# Altium schematic sheet magic_baton_top.SchDoc: Magic Baton: Top Sheet
size Letter; Organization: UBC ECE Capstone 2020S; Address1: Team 8; Address3: Magic Baton; Revision: A
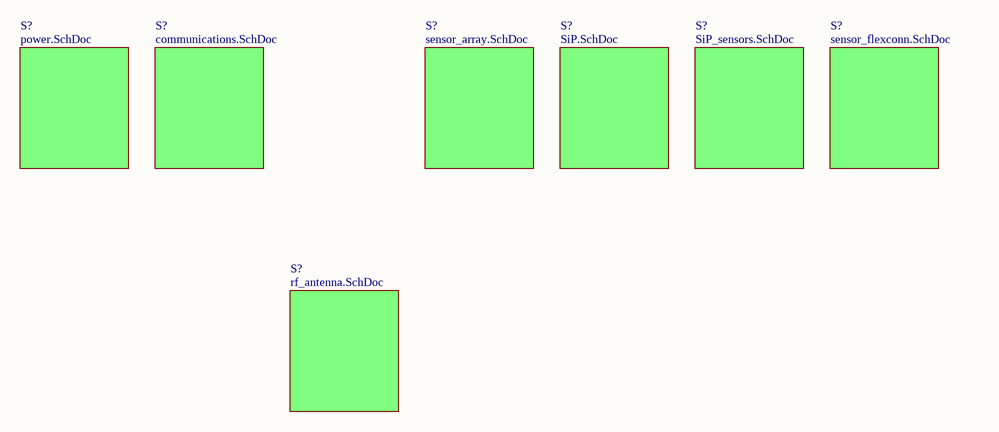
[diagram p0: magic_baton_top.SchDoc]

## Sub-sheets
S? = power.SchDoc: no entries
S? = communications.SchDoc: no entries
S? = rf_antenna.SchDoc: no entries
S? = sensor_array.SchDoc: no entries
S? = SiP.SchDoc: no entries
S? = SiP_sensors.SchDoc: no entries
S? = sensor_flexconn.SchDoc: no entries

## Notes on the sheet
- Title
- Size:
- Date:
- Letter
- Number:
- Time:
- Revision:
- Sheet
- of
- File: